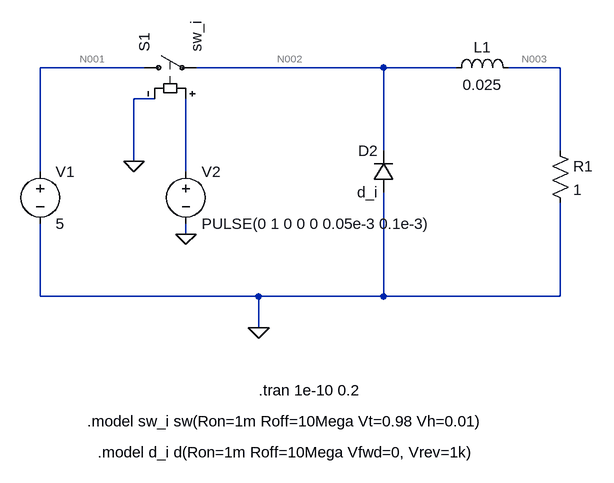
[diagram p0: schematic Circuito_pratica1.asc]
Circuito_pratica1.asc, the LTspice schematic file:
Version 4
SHEET 1 880 680
WIRE 144 -32 -16 -32
WIRE 512 -32 224 -32
WIRE 624 -32 512 -32
WIRE 784 -32 704 -32
WIRE 160 16 128 16
WIRE 512 96 512 -32
WIRE 784 96 784 -32
WIRE 128 112 128 16
WIRE -16 128 -16 -32
WIRE 208 128 208 16
WIRE 208 224 208 208
WIRE -16 320 -16 208
WIRE 320 320 -16 320
WIRE 512 320 512 160
WIRE 512 320 320 320
WIRE 784 320 784 176
WIRE 784 320 512 320
WIRE 320 368 320 320
FLAG 208 224 0
FLAG 128 112 0
FLAG 320 368 0
SYMBOL voltage -16 112 R0
WINDOW 123 0 0 Left 0
WINDOW 39 0 0 Left 0
SYMATTR InstName V1
SYMATTR Value 5
SYMBOL voltage 208 112 R0
WINDOW 123 0 0 Left 0
WINDOW 39 0 0 Left 0
SYMATTR InstName V2
SYMATTR Value PULSE(0 1 0 0 0 0.05e-3 0.1e-3)
SYMBOL diode 528 160 R180
WINDOW 0 24 64 Left 2
WINDOW 3 24 0 Left 2
SYMATTR InstName D2
SYMATTR Value d_i
SYMBOL ind 608 -16 R270
WINDOW 0 32 56 VTop 2
WINDOW 3 5 56 VBottom 2
SYMATTR InstName L1
SYMATTR Value 0.025
SYMBOL res 768 80 R0
SYMATTR InstName R1
SYMATTR Value 1
SYMBOL sw 128 -32 R270
SYMATTR InstName S1
SYMATTR Value sw_i
TEXT 56 512 Left 2 !.model sw_i sw(Ron=1m Roff=10Mega Vt=0.98 Vh=0.01)
TEXT 72 560 Left 2 !.model d_i d(Ron=1m Roff=10Mega Vfwd=0, Vrev=1k)
TEXT 320 464 Left 2 !.tran 1e-10 0.2

The netlist it stands for:
* Circuito_pratica1.asc
V1 N001 0 5
V2 N004 0 PULSE(0 1 0 0 0 0.05e-3 0.1e-3)
D2 0 N002 d_i
L1 N002 N003 0.025
R1 N003 0 1
S1 N001 N002 N004 0 sw_i
.model D D
.lib standard.dio
.model sw_i sw(Ron=1m Roff=10Mega Vt=0.98 Vh=0.01)
.model d_i d(Ron=1m Roff=10Mega Vfwd=0, Vrev=1k)
.tran 1e-10 0.2
.backanno
.end

* Results of the author's LTspice run, read from the files saved beside the schematic
* Operating Point, zero values left out:
*   V(n001) = 5 V
*   V(n002) = 500.5 nV
*   V(n003) = 500 nV
*   I(L1) = 500 nA
*   I(R1) = 500 nA
*   I(S1) = -500 nA
*   I(V1) = -500 nA
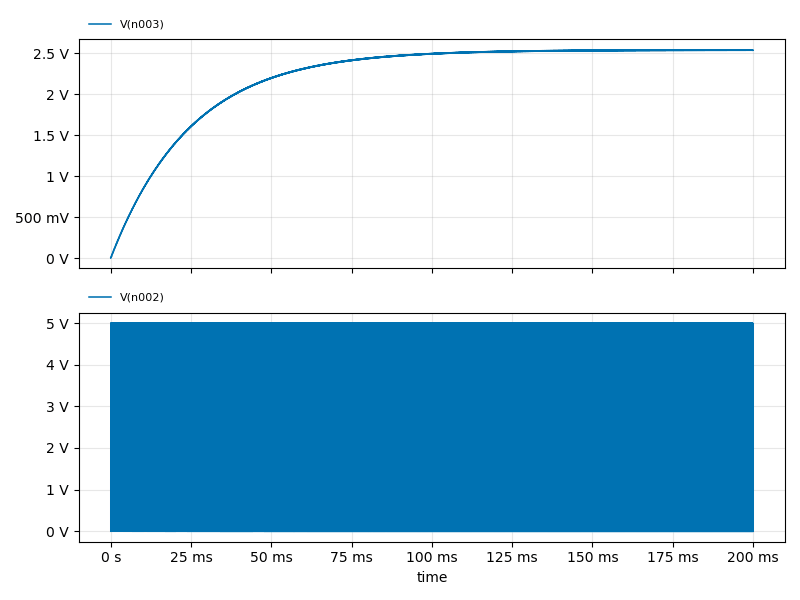
[diagram p1: Transient Analysis of Circuito_pratica1.asc, plotted from the saved traces]
* Transient Analysis, 1 run:
*   V(n003): min 500 nV, max 2.541 V, average 2.223 V, rms 2.29 V, last 2.537 V
*   V(n002): min -2.541 mV, max 5 V, average 2.59 V, rms 3.581 V, last -2.537 mV